# Altium schematic sheet MCU_CONNECT.SchDoc: Y1701
size A3; Date: 2018.11.13; Author: Xianrui; CompanyName: 成都捷祥医疗器械有限公司; Revision: V1.0; SheetNumber: 5; SheetTotal: 6
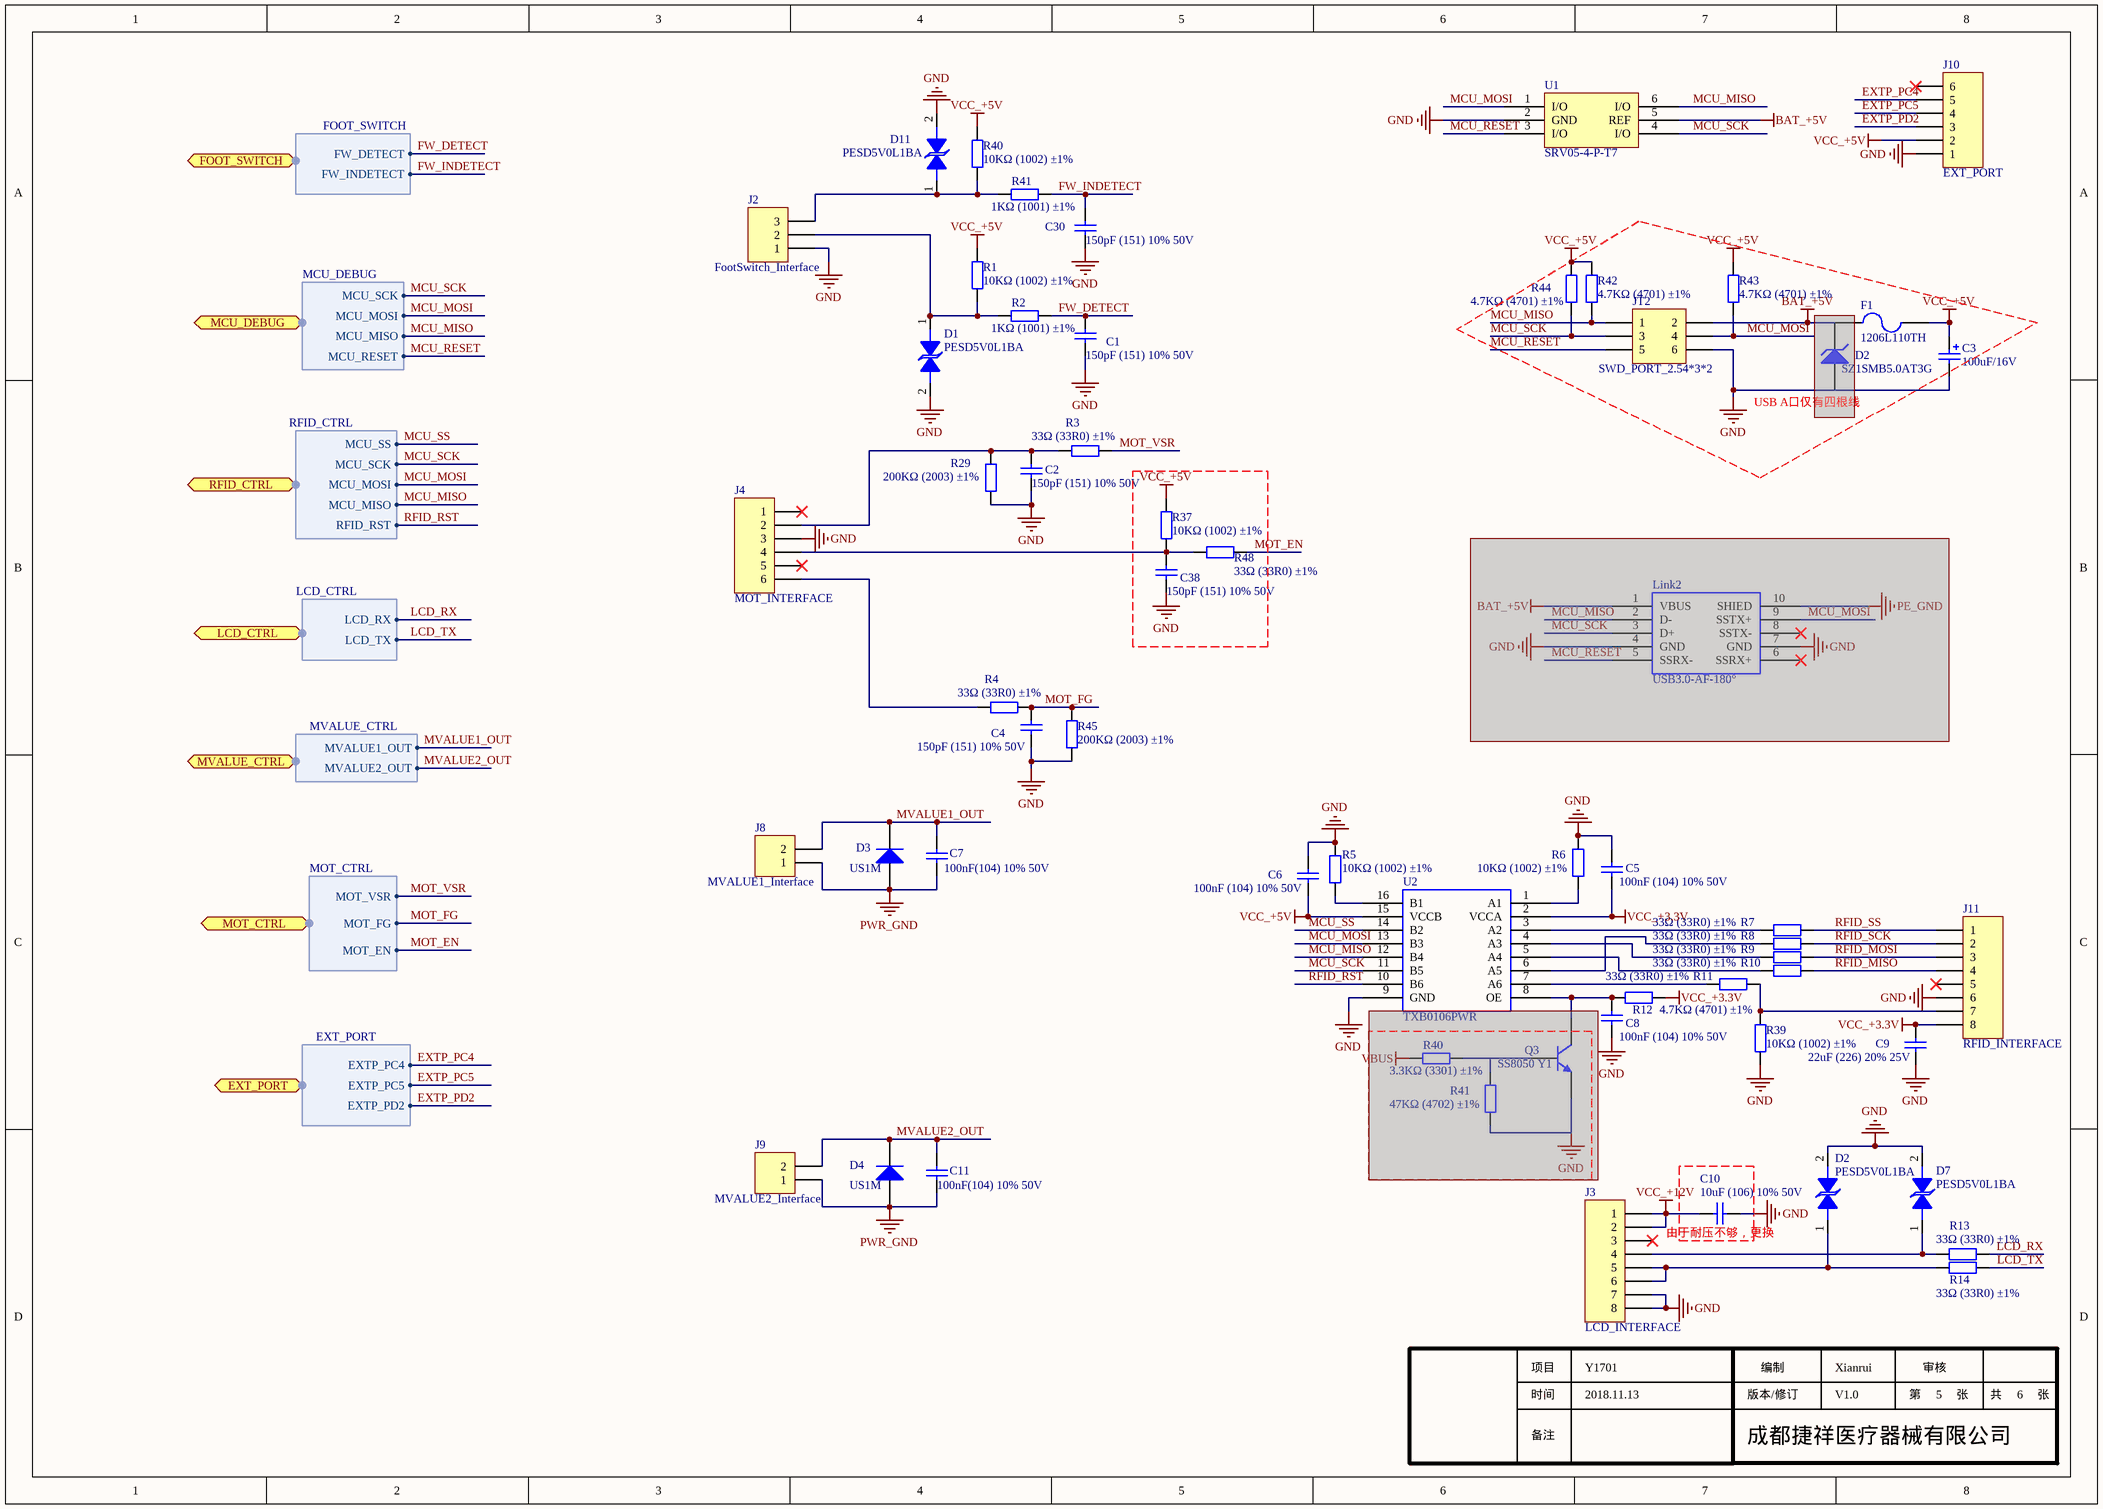
[diagram p0: MCU_CONNECT.SchDoc]

## Parts
(Parts that share a designator on the sheet are numbered #1, #2 ... from top to bottom, then left to right.)
C1  150pF (151) 10% 50V  [LC-0603_C]
C2  150pF (151) 10% 50V  [LC-0603_C]
C3  100uF/16V  [RCCT-6032C]
C4  150pF (151) 10% 50V  [LC-0603_C]
C5  100nF (104) 10% 50V  [LC-0603_C]
C6  100nF (104) 10% 50V  [LC-0603_C]
C7  100nF(104) 10% 50V  [LC-0805_C]
C8  100nF (104) 10% 50V  [LC-0603_C]
C9  22uF (226) 20% 25V  [LC-0805_C]
C10  10uF (106) 10% 50V  [LC-1206_C]
C11  100nF(104) 10% 50V  [LC-0805_C]
C30  150pF (151) 10% 50V  [LC-0603_C]
C38  150pF (151) 10% 50V  [LC-0603_C]
D1  PESD5V0L1BA  [RCD-SOD323-N]
D2#1  SZ1SMB5.0AT3G  [RCD-SMBTH]  (masked out: inside a compile mask, not in the netlist)
D2#2  PESD5V0L1BA  [RCD-SOD323-N]
D3  US1M  [LC-SMA(DO-214AC)_S1]
D4  US1M  [LC-SMA(DO-214AC)_S1]
D7  PESD5V0L1BA  [RCD-SOD323-N]
D11  PESD5V0L1BA  [RCD-SOD323-N]
F1  1206L110TH  [RCF1206TH]
J2  FootSwitch_Interface  [RCJ2.5-3CA]
J3  LCD_INTERFACE  [RCJ-XH2.54-8P]
J4  MOT_INTERFACE  [RCJ-XH2.54-6P]
J8  MVALUE1_Interface  [RCJ3.96-2CA]
J9  MVALUE2_Interface  [RCJ3.96-2CA]
J10  EXT_PORT  [RCJ-XH2.54-6P]
J11  RFID_INTERFACE  [RCJ-XH2.54-8P]
JT2  SWD_PORT_2.54*3*2  [RCJ2.5-2X3CA]
Link2  USB3.0-AF-180°  [RCJ-USB3.0-AF-180]  (masked out: inside a compile mask, not in the netlist)
Q3  SS8050 Y1  [LC-SOT-23(SOT-23-3)]  (masked out: inside a compile mask, not in the netlist)
R1  10KΩ (1002) ±1%  [LC-0603_R]
R2  1KΩ (1001) ±1%  [LC-0603_R]
R3  33Ω (33R0) ±1%  [LC-0603_R]
R4  33Ω (33R0) ±1%  [LC-0603_R]
R5  10KΩ (1002) ±1%  [LC-0603_R]
R6  10KΩ (1002) ±1%  [LC-0603_R]
R7  33Ω (33R0) ±1%  [LC-0603_R]
R8  33Ω (33R0) ±1%  [LC-0603_R]
R9  33Ω (33R0) ±1%  [LC-0603_R]
R10  33Ω (33R0) ±1%  [LC-0603_R]
R11  33Ω (33R0) ±1%  [LC-0603_R]
R12  4.7KΩ (4701) ±1%  [LC-0603_R]
R13  33Ω (33R0) ±1%  [LC-0603_R]
R14  33Ω (33R0) ±1%  [LC-0603_R]
R29  200KΩ (2003) ±1%  [LC-0603_R]
R37  10KΩ (1002) ±1%  [LC-0603_R]
R39  10KΩ (1002) ±1%  [LC-0603_R]
R40#1  10KΩ (1002) ±1%  [LC-0603_R]
R40#2  3.3KΩ (3301) ±1%  [LC-0603_R]  (masked out: inside a compile mask, not in the netlist)
R41#1  1KΩ (1001) ±1%  [LC-0603_R]
R41#2  47KΩ (4702) ±1%  [LC-0603_R]  (masked out: inside a compile mask, not in the netlist)
R42  4.7KΩ (4701) ±1%  [LC-0603_R]
R43  4.7KΩ (4701) ±1%  [LC-0603_R]
R44  4.7KΩ (4701) ±1%  [LC-0603_R]
R45  200KΩ (2003) ±1%  [LC-0603_R]
R48  33Ω (33R0) ±1%  [LC-0603_R]
U1  SRV05-4-P-T7  [LC-SOT-23-6]
U2  TXB0106PWR  [RCIC-TSSOP16]

## Blocks framed on the sheet
USB A口仅有四根线: C3 D2#1 F1 JT2 R42-R44

## Ports
EXT_PORT (harness EXT_PORT), FOOT_SWITCH (harness FOOT_SWITCH), LCD_CTRL (harness LCD_CTRL), MCU_DEBUG (harness MCU_DEBUG), MOT_CTRL (harness MOT_CTRL), MVALUE_CTRL (harness MVALUE_CTRL), RFID_CTRL (harness RFID_CTRL)

## Harnesses
RFID_CTRL: MCU_SS, MCU_SCK, MCU_MOSI, MCU_MISO, RFID_RST
MCU_DEBUG: MCU_SCK, MCU_MOSI, MCU_MISO, MCU_RESET
LCD_CTRL: LCD_RX, LCD_TX
MVALUE_CTRL: MVALUE1_OUT, MVALUE2_OUT
MOT_CTRL: MOT_VSR, MOT_FG, MOT_EN
FOOT_SWITCH: FW_DETECT, FW_INDETECT
EXT_PORT: EXTP_PC4, EXTP_PC5, EXTP_PD2

## Nets
BAT_+5V: F1.2 JT2.2 U1.5(REF)
GND: C1.1 C2.1 C3.2 C4.1 C5.2 C6.2 C8.1 C9.1 C10.2 C30.1 C38.1 D1.2 D2#2.2 D7.2 D11.2 J2.1 J3.7 J3.8 J4.3 J10.1 J11.6 JT2.6 R5.2 R6.2 R29.1 R39.1 R45.1 U1.2(GND) U2.9(GND)
PWR_GND: C7.2 C11.2 D3.1(A) D4.1(A) J8.1 J9.1
VCC_+3.3V: C5.1 C9.2 J11.8 R12.2 U2.2(VCCA)
VCC_+5V: C3.1 C6.1 F1.1 J10.2 R1.2 R37.1 R40#1.2 R42.1 R43.1 R44.1 U2.15(VCCB)
VCC_+12V: C10.1 J3.1 J3.2
EXTP_PC4: J10.5 ; port EXT_PORT.EXTP_PC4
EXTP_PC5: J10.4 ; port EXT_PORT.EXTP_PC5
EXTP_PD2: J10.3 ; port EXT_PORT.EXTP_PD2
FW_DETECT: C1.2 R2.2 ; port FOOT_SWITCH.FW_DETECT
FW_INDETECT: C30.2 R41#1.2 ; port FOOT_SWITCH.FW_INDETECT
LCD_RX: R13.2 ; port LCD_CTRL.LCD_RX
LCD_TX: R14.2 ; port LCD_CTRL.LCD_TX
MCU_MISO: JT2.1 R42.2 U1.6(I/O) U2.12(B4) ; port RFID_CTRL.MCU_MISO, port MCU_DEBUG.MCU_MISO
MCU_MOSI: JT2.4 R43.2 U1.1(I/O) U2.13(B3) ; port RFID_CTRL.MCU_MOSI, port MCU_DEBUG.MCU_MOSI
MCU_RESET: JT2.5 U1.3(I/O) ; port MCU_DEBUG.MCU_RESET
MCU_SCK: JT2.3 R44.2 U1.4(I/O) U2.11(B5) ; port RFID_CTRL.MCU_SCK, port MCU_DEBUG.MCU_SCK
MCU_SS: U2.14(B2) ; port RFID_CTRL.MCU_SS
MOT_EN: R48.2 ; port MOT_CTRL.MOT_EN
MOT_FG: C4.2 R4.2 R45.2 ; port MOT_CTRL.MOT_FG
MOT_VSR: R3.2 ; port MOT_CTRL.MOT_VSR
MVALUE1_OUT: C7.1 D3.2(K) J8.2 ; port MVALUE_CTRL.MVALUE1_OUT
MVALUE2_OUT: C11.1 D4.2(K) J9.2 ; port MVALUE_CTRL.MVALUE2_OUT
RFID_MISO: J11.4 R10.2
RFID_MOSI: J11.3 R9.2
RFID_RST: U2.10(B6) ; port RFID_CTRL.RFID_RST
RFID_SCK: J11.2 R8.2
RFID_SS: J11.1 R7.2
NetC2_2: C2.2 J4.2 R3.1 R29.2
NetC8_2: C8.2 R12.1 U2.8(OE)
NetC38_2: C38.2 J4.4 R37.2 R48.1
NetD1_1: D1.1 J2.2 R1.1 R2.1
NetD2#2_1: D2#2.1 J3.5 J3.6 R14.1
NetD7_1: D7.1 J3.4 R13.1
NetD11_1: D11.1 J2.3 R40#1.1 R41#1.1
NetJ4_6: J4.6 R4.1
NetJ11_7: J11.7 R11.2 R39.2
NetR5_1: R5.1 U2.16(B1)
NetR6_1: R6.1 U2.1(A1)
NetR7_1: R7.1 U2.3(A2)
NetR8_1: R8.1 U2.6(A5)
NetR9_1: R9.1 U2.4(A3)
NetR10_1: R10.1 U2.5(A4)
NetR11_1: R11.1 U2.7(A6)

Not connected (* = marked no-connect by the designer): J3 3*; J4 1* 5*; J10 6*; J11 5*

## Notes on the sheet
- (near C10) 由于耐压不够，更换
- 项目
- 时间
- 版本/修订
- 编制
- 第
- 审核
- 张
- 共
- 备注

## Library data of the parts
C1 C2 C4 C30 C38 = 0603 150pF (151) 10% 50V: 贴片电容; ComponentLink1Description: 供应商链接; ComponentLink1URL: http://www.szlcsc.com/product/details_1946.html; Package: 0603; Supplier: LC; SuppliersPartNumber: C1594
C3 = Cap_polar: 有极性电容; Manufacture: AVX; Ordering: TAJB226M020RNJ; Comments: 100uF/16V; Libnum: *
C5 C6 C8 = 0603 100nF (104) 10% 50V: 贴片电容; ComponentLink1Description: 供应商链接; ComponentLink1URL: http://www.szlcsc.com/product/details_15331.html; Package: 0603; Supplier: LC; SuppliersPartNumber: C14663
C7 C11 = 0805 100nF(104) 10% 50V: 贴片电容; ComponentLink1Description: 供应商链接; ComponentLink1URL: http://www.szlcsc.com/product/details_50686.html; Package: 0805; Supplier: LC; SuppliersPartNumber: C49678
C9 = 0805 22uF (226) 20% 25V: 贴片电容; ComponentLink1Description: 供应商链接; ComponentLink1URL: http://www.szlcsc.com/product/details_46786.html; Package: 0805; Supplier: LC; SuppliersPartNumber: C45783
C10 = 1206 10uF (106) 10% 50V: 贴片电容; ComponentLink1Description: 供应商链接; ComponentLink1URL: http://www.szlcsc.com/product/details_14236.html; Package: 1206; Supplier: LC; SuppliersPartNumber: C13585
D1 D2#2 D7 D11 = TVS Diode: TVS; Manufacture: nexperia; Ordering: ESD5V32D-LC; Comments: PESD5V0L1BA; Libnum: *
D2#1 = DiodeA: Zener,Tvs; Comments: SZ1SMB5.0AT3G; Libnum: *; Manufacture: *; Ordering: SZ1SMB5.0AT3G
D3 D4 = SMA(DO-214AC) US1M: 二极管; ComponentLink1Description: 供应商链接; ComponentLink1URL: http://www.szlcsc.com/product/details_5885.html; Package: SMA(DO-214AC); Supplier: LC; SuppliersPartNumber: C5441
F1 = FUSE: Manufacture: LittleFuse; Comments: 1206L110TH; Libnum: *; Ordering: 1206L110TH
J2 = JCJ-1-3: 3 Pin 接插件; Comments: FootSwitch_Interface; Lib: *; Manufacture: *; Ordering: *; LC: *
J3 J11 = Header 8: Header, 8-Pin; LatestRevisionDate: 17-Jul-2002; LatestRevisionNote: Re-released for DXP Platform.; Publisher: Altium Limited
J4 J10 = Header 6: Header, 6-Pin; LatestRevisionDate: 17-Jul-2002; LatestRevisionNote: Re-released for DXP Platform.; Publisher: Altium Limited
J8 J9 = Header 2: Header, 2-Pin; LatestRevisionDate: 17-Jul-2002; LatestRevisionNote: Re-released for DXP Platform.; Publisher: Altium Limited
JT2 = SWD_PORT_2.54*3*2: MCU Debug Port 6 Pin for Atmega MCU; Comments: SWD_PORT_2.54*3*2; Libnum: *; Manufacture: *; Odering: *
Link2 = USB3.0: USB 3.0 AF 90度; Manufacture: 深圳华联威电子; Ordering: U323-012X-XXX0X1; Comments: USB3.0-AF-180°; Libnum: *
Q3 = SOT-23 SS8050 Y1: 三极管; ComponentLink1Description: 供应商链接; ComponentLink1URL: http://www.szlcsc.com/product/details_2507.html; Package: SOT-23; Supplier: LC; SuppliersPartNumber: C2150
R1 R5 R6 R37 R39 R40#1 = 0603 10KΩ (1002) 1%: 贴片电阻; ComponentLink1Description: 供应商链接; ComponentLink1URL: http://www.szlcsc.com/product/details_26547.html; Package: 0603; Supplier: LC; SuppliersPartNumber: C25804
R2 R41#1 = 0603 1KΩ (1001) 1%: 贴片电阻; ComponentLink1Description: 供应商链接; ComponentLink1URL: http://www.szlcsc.com/product/details_21904.html; Package: 0603; Supplier: LC; SuppliersPartNumber: C21190
R3 R4 R7-R11 R13 R14 R48 = 0603 33Ω (33R0) 1%: 贴片电阻; ComponentLink1Description: 供应商链接; ComponentLink1URL: http://www.szlcsc.com/product/details_23867.html; Package: 0603; Supplier: LC; SuppliersPartNumber: C23140
R12 R42-R44 = 0603 4.7KΩ (4701) 1%: 贴片电阻; ComponentLink1Description: 供应商链接; ComponentLink1URL: http://www.szlcsc.com/product/details_23889.html; Package: 0603; Supplier: LC; SuppliersPartNumber: C23162
R29 R45 = 0603 200KΩ (2003) 1%: 贴片电阻; ComponentLink1Description: 供应商链接; ComponentLink1URL: http://www.szlcsc.com/product/details_26554.html; Package: 0603; Supplier: LC; SuppliersPartNumber: C25811
R40#2 = 0603 3.3KΩ (3301) 1%: 贴片电阻; ComponentLink1Description: 供应商链接; ComponentLink1URL: http://www.szlcsc.com/product/details_23705.html; Package: 0603; Supplier: LC; SuppliersPartNumber: C22978
R41#2 = 0603 47KΩ (4702) 1%: 贴片电阻; ComponentLink1Description: 供应商链接; ComponentLink1URL: http://www.szlcsc.com/product/details_26562.html; Package: 0603; Supplier: LC; SuppliersPartNumber: C25819
U1 = SRV05-4-P-T7: TVS; ComponentLink1Description: 供应商链接; ComponentLink1URL: http://www.szlcsc.com/product/details_86537.html; Package: SOT-23-6; Supplier: LC; SuppliersPartNumber: C85364
U2 = TXB0106: Octal D type transparent latch; Manufacture: TI; Comments: TXB0106PWR; Libnum: *; Ordering: TXB0106PWR